# Altium schematic sheet Cougar Power_SE_Altium.SchDoc
size A4
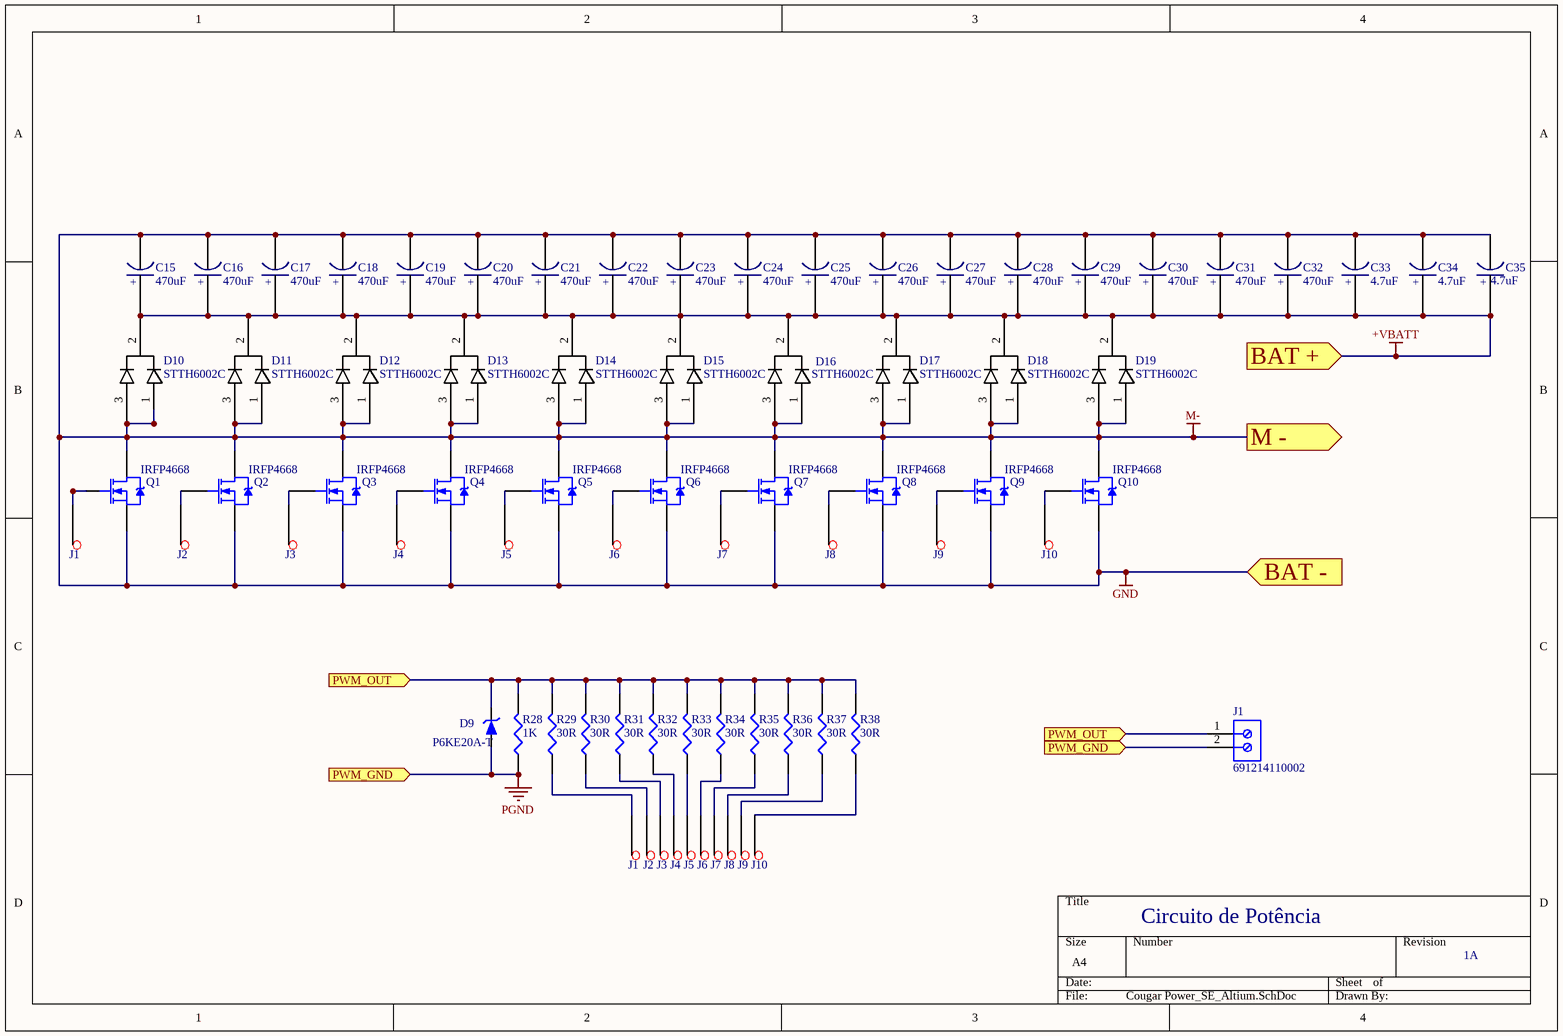
[diagram p0: Cougar Power_SE_Altium.SchDoc]

## Parts
(Parts that share a designator on the sheet are numbered #1, #2 ... from top to bottom, then left to right.)
C15  470uF  [CAPPRS10-25x40]
C16  470uF  [CAPPRS10-25x40]
C17  470uF  [CAPPRS10-25x40]
C18  470uF  [CAPPRS10-25x40]
C19  470uF  [CAPPRS10-25x40]
C20  470uF  [CAPPRS10-25x40]
C21  470uF  [CAPPRS10-25x40]
C22  470uF  [CAPPRS10-25x40]
C23  470uF  [CAPPRS10-25x40]
C24  470uF  [CAPPRS10-25x40]
C25  470uF  [CAPPRS10-25x40]
C26  470uF  [CAPPRS10-25x40]
C27  470uF  [CAPPRS10-25x40]
C28  470uF  [CAPPRS10-25x40]
C29  470uF  [CAPPRS10-25x40]
C30  470uF  [CAPPRS10-25x40]
C31  470uF  [CAPPRS10-25x40]
C32  470uF  [CAPPRS10-25x40]
C33  4.7uF  [CAPPRS10-25x40]
C34  4.7uF  [CAPPRS10-25x40]
C35  4.7uF  [CAPPRS10-25x40]
D9  P6KE20A-T  [DIODE/AXIAL/11/3/0.9]
D10  STTH6002C  [TO-247]
D11  STTH6002C  [TO-247]
D12  STTH6002C  [TO-247]
D13  STTH6002C  [TO-247]
D14  STTH6002C  [TO-247]
D15  STTH6002C  [TO-247]
D16  STTH6002C  [TO-247]
D17  STTH6002C  [TO-247]
D18  STTH6002C  [TO-247]
D19  STTH6002C  [TO-247]
J1#1  SIN-002T-1.0  [SIN-002T-1.0]  (value not drawn)
J1#2  691214110002  [691214110002]
J1#3  SIN-002T-1.0  [SIN-002T-1.0]  (value not drawn)
J2#1  SIN-002T-1.0  [SIN-002T-1.0]  (value not drawn)
J2#2  SIN-002T-1.0  [SIN-002T-1.0]  (value not drawn)
J3#1  SIN-002T-1.0  [SIN-002T-1.0]  (value not drawn)
J3#2  SIN-002T-1.0  [SIN-002T-1.0]  (value not drawn)
J4#1  SIN-002T-1.0  [SIN-002T-1.0]  (value not drawn)
J4#2  SIN-002T-1.0  [SIN-002T-1.0]  (value not drawn)
J5#1  SIN-002T-1.0  [SIN-002T-1.0]  (value not drawn)
J5#2  SIN-002T-1.0  [SIN-002T-1.0]  (value not drawn)
J6#1  SIN-002T-1.0  [SIN-002T-1.0]  (value not drawn)
J6#2  SIN-002T-1.0  [SIN-002T-1.0]  (value not drawn)
J7#1  SIN-002T-1.0  [SIN-002T-1.0]  (value not drawn)
J7#2  SIN-002T-1.0  [SIN-002T-1.0]  (value not drawn)
J8#1  SIN-002T-1.0  [SIN-002T-1.0]  (value not drawn)
J8#2  SIN-002T-1.0  [SIN-002T-1.0]  (value not drawn)
J9#1  SIN-002T-1.0  [SIN-002T-1.0]  (value not drawn)
J9#2  SIN-002T-1.0  [SIN-002T-1.0]  (value not drawn)
J10#1  SIN-002T-1.0  [SIN-002T-1.0]  (value not drawn)
J10#2  SIN-002T-1.0  [SIN-002T-1.0]  (value not drawn)
Q1  IRFP4668  [TO-247AC]
Q2  IRFP4668  [TO-247AC]
Q3  IRFP4668  [TO-247AC]
Q4  IRFP4668  [TO-247AC]
Q5  IRFP4668  [TO-247AC]
Q6  IRFP4668  [TO-247AC]
Q7  IRFP4668  [TO-247AC]
Q8  IRFP4668  [TO-247AC]
Q9  IRFP4668  [TO-247AC]
Q10  IRFP4668  [TO-247AC]
R28  1K  [AXIAL0.4]
R29  30R  [axial-0.4]
R30  30R  [axial-0.4]
R31  30R  [axial-0.4]
R32  30R  [axial-0.4]
R33  30R  [axial-0.4]
R34  30R  [axial-0.4]
R35  30R  [axial-0.4]
R36  30R  [axial-0.4]
R37  30R  [axial-0.4]
R38  30R  [axial-0.4]

## Ports
BAT + (in), BAT - (in), M - (out), PWM_GND (in), PWM_OUT (in)

## Nets
+VBATT: C15.1 C16.1 C17.1 C18.1 C19.1 C20.1 C21.1 C22.1 C23.1 C24.1 C25.1 C26.1 C27.1 C28.1 C29.1 C30.1 C31.1 C32.1 C33.1 C34.1 C35.1 D10.2 D11.2 D12.2 D13.2 D14.2 D15.2 D16.2 D17.2 D18.2 D19.2 ; port BAT +
GND: C15.2 C16.2 C17.2 C18.2 C19.2 C20.2 C21.2 C22.2 C23.2 C24.2 C25.2 C26.2 C27.2 C28.2 C29.2 C30.2 C31.2 C32.2 C33.2 C34.2 C35.2 D10.1 D10.3 D11.1 D11.3 D12.1 D12.3 D13.1 D13.3 D14.1 D14.3 D15.1 D15.3 D16.1 D16.3 D17.1 D17.3 D18.1 D18.3 D19.1 D19.3 Q1.2(D) Q1.3(S) Q2.2(D) Q2.3(S) Q3.2(D) Q3.3(S) Q4.2(D) Q4.3(S) Q5.2(D) Q5.3(S) Q6.2(D) Q6.3(S) Q7.2(D) Q7.3(S) Q8.2(D) Q8.3(S) Q9.2(D) Q9.3(S) Q10.2(D) Q10.3(S) ; port BAT -, port M -  [also labelled M-]
PGND: D9.1(K) J1#2.2 R28.1 ; port PWM_GND
PWM_OUT: D9.2(A) J1#2.1 R28.2 R29.2 R30.2 R31.2 R32.2 R33.2 R34.2 R35.2 R36.2 R37.2 R38.2 ; port PWM_OUT
NetJ1#1_1: J1#1.1 Q1.1(G)
NetJ1#3_1: J1#3.1 R29.1
NetJ2#1_1: J2#1.1 Q2.1(G)
NetJ2#2_1: J2#2.1 R30.1
NetJ3#1_1: J3#1.1 Q3.1(G)
NetJ3#2_1: J3#2.1 R31.1
NetJ4#1_1: J4#1.1 Q4.1(G)
NetJ4#2_1: J4#2.1 R32.1
NetJ5#1_1: J5#1.1 Q5.1(G)
NetJ5#2_1: J5#2.1 R33.1
NetJ6#1_1: J6#1.1 Q6.1(G)
NetJ6#2_1: J6#2.1 R34.1
NetJ7#1_1: J7#1.1 Q7.1(G)
NetJ7#2_1: J7#2.1 R35.1
NetJ8#1_1: J8#1.1 Q8.1(G)
NetJ8#2_1: J8#2.1 R36.1
NetJ9#1_1: J9#1.1 Q9.1(G)
NetJ9#2_1: J9#2.1 R37.1
NetJ10#1_1: J10#1.1 Q10.1(G)
NetJ10#2_1: J10#2.1 R38.1

## Notes on the sheet
- Circuito de Potência
- 1A
- (in symbol CAPPRS10-25x40) +

## Library data of the parts
C15-C35 = CAPPRS10-25x40
D9 = TRANSZORB-UNIDIRECTIONAL
D10-D19 = STTH2002C
J1#2 = CMP-1502-02464-2: NexarPartId: 18818288; Plating: Brass, Steel; Current: 10A; Pitch: 3.5052mm; Number of Levels: 1; Number of Contacts: 2; Wire Gauge (Min): 16AWG; Voltage: 300V; Wire Gauge (Max): 24AWG; Stripping Length: -6mm; Number of Pins: 2; Number of Rows: 1; REACH SVHC: Unknown; RoHS: Compliant; Housing Material: Nylon; Termination: Screw; Mount: Through Hole; Contact Plating: Brass, Tin; Number of Positions Per Level: 2; Color: Blue, Green; Width: 7.9mm; Voltage Rating: 300V; Length: 7.4mm; Current Rating: 10A; Wire/Cable Gauge: 24AWG; Packaging: Box; Max Operating Temperature: 105°C; Lead Pitch: 3.5mm; Height: 8.7mm; Contact Material: Brass; Min Operating Temperature: -40°C
Q1-Q10 = IRFP460: HEXFET Power MOSFET; Note: Pin 2 is electrically connected to the Heatsink (4).; Published: 8-Jun-2000; LatestRevisionDate: 17-Jul-2002; LatestRevisionNote: Re-released for DXP Platform.; DatasheetVersion: PD-9.512B; PackageVersion: Aug-1997; PackageReference: TO-247AC; Publisher: Altium Limited; PackageDescription: SIP with Mounting Hole; 3 Leads; Body 20 x 15.6 x 5 mm (typ); Pitch 5.45 mm; Code_JEDEC: TO-247-AC; ComponentLink1Description: Manufacturer Link; ComponentLink1URL: http://www.irf.com/; ComponentLink2Description: Datasheet; ComponentLink2URL: http://www.irf.com/product-info/datasheets/data/irfp460.pdf
R28-R38 = RES1